# EAGLE design Zio Qwiic MP3 Player (EAGLE 9.1.1)
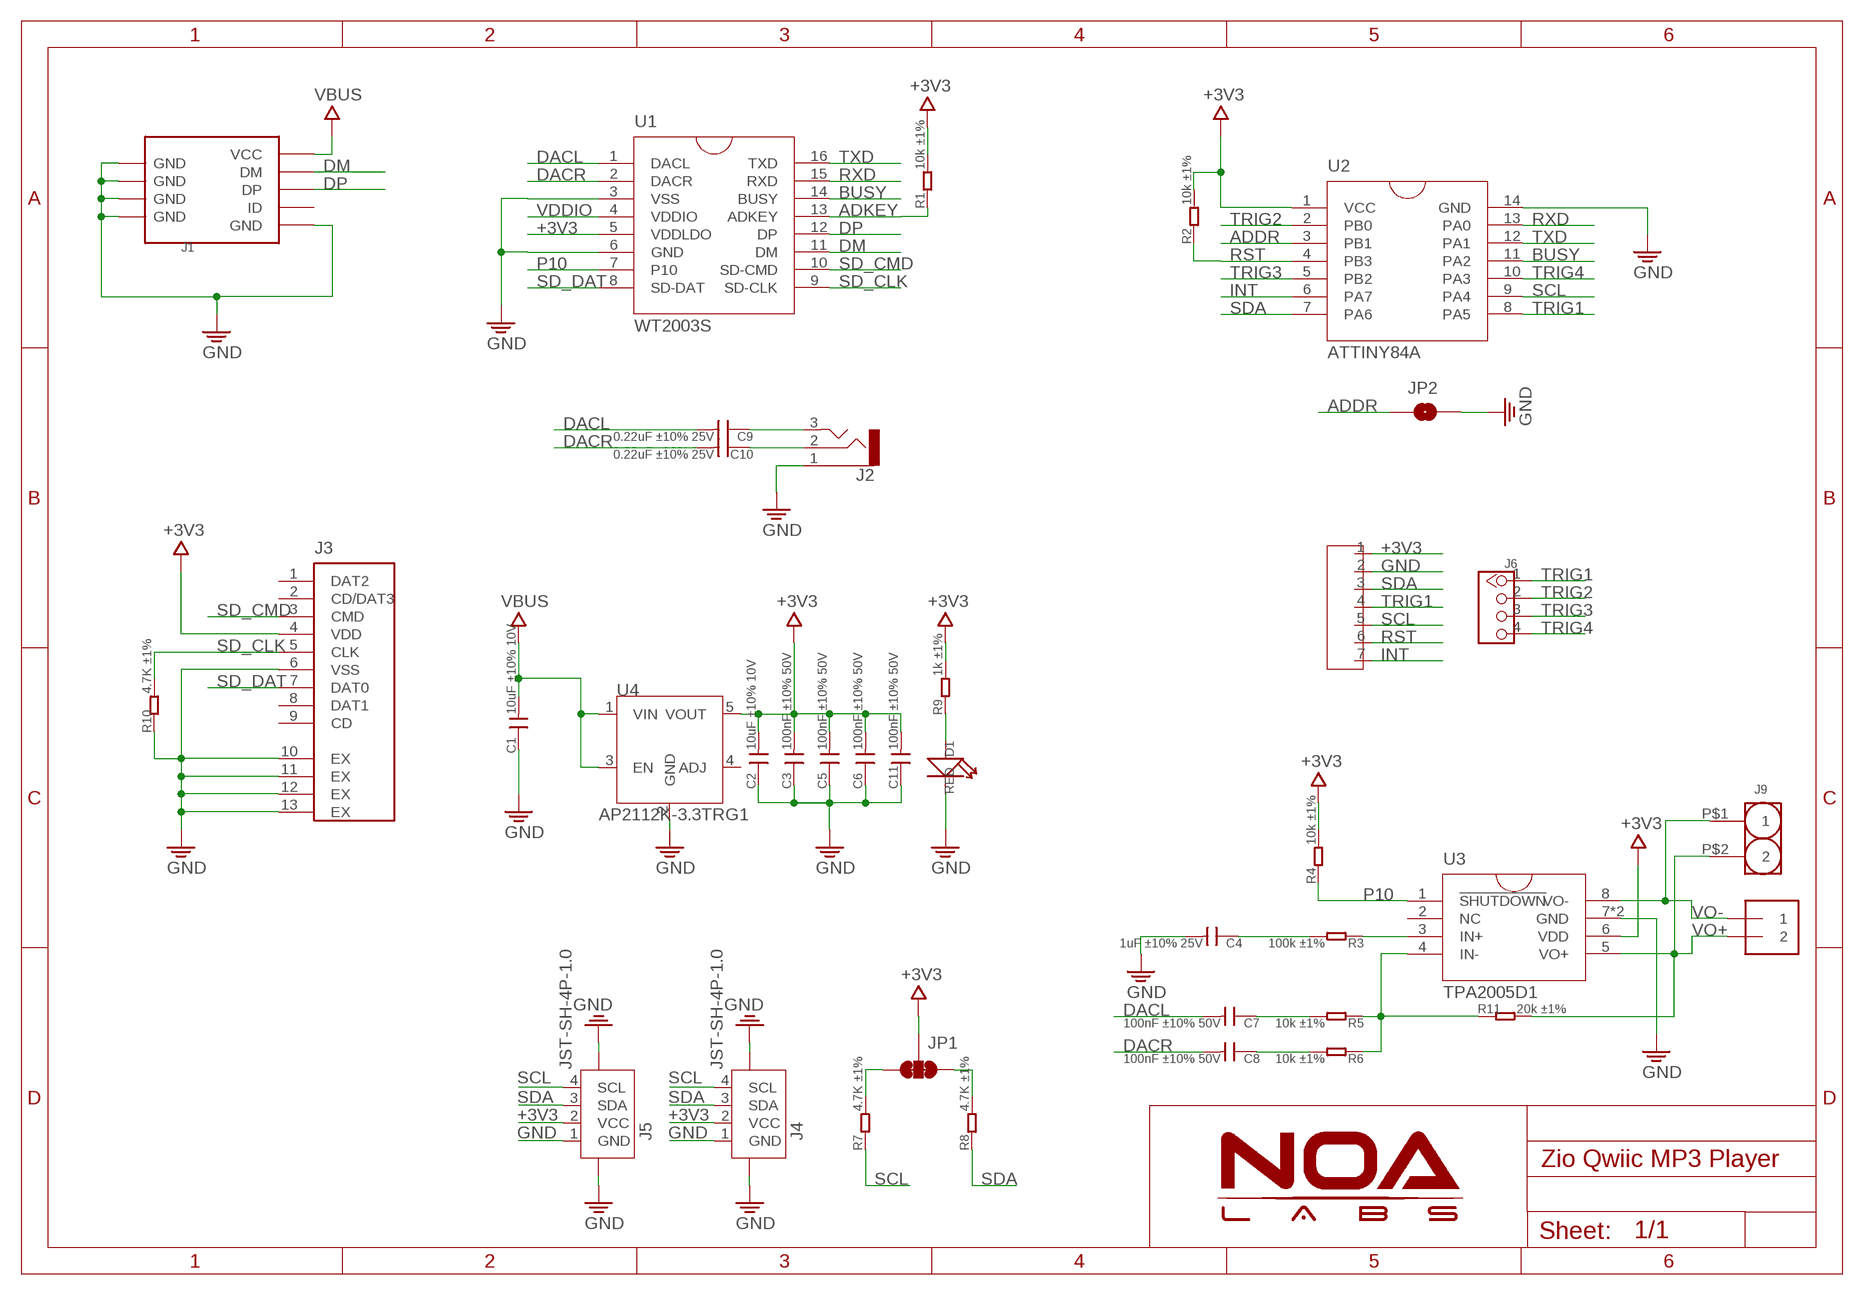
[diagram p0: schematic, sheet 1]

## Parts
C1  10uF ±10% 10V  C-0603  [C0603]
C2  10uF ±10% 10V  C-0603  [C0603]
C3  100nF ±10% 50V  C-0603  [C0603]
C4  1uF ±10% 25V  C-0603  [C0603]
C5  100nF ±10% 50V  C-0603  [C0603]
C6  100nF ±10% 50V  C-0603  [C0603]
C7  100nF ±10% 50V  C-0603  [C0603]
C8  100nF ±10% 50V  C-0603  [C0603]
C9  0.22uF ±10% 25V  C-0603  [C0603]
C10  0.22uF ±10% 25V  C-0603  [C0603]
C11  100nF ±10% 50V  C-0603  [C0603]
D1  RED  LED'0603'  [LED-0603]
J1  USB-MICROE  [MICRO-SMD]
J2  AUDIO-3PPJ-320B  [3P-SMD-3.5MM]
J3  TF_CARD  [TF_CARD]
J4  JST-SH-4P-1.0  [JST-SH-4P]
J5  JST-SH-4P-1.0  [JST-SH-4P]
J6  HEADER-4P-60/35MIL  [4P-65/35MIL]
J7  HEADER-7P  [7P-2.54-60/35MIL]
J8  TERMBLOCK_1X2-3.5MM  [1X2-3.5MM]
J9  HEADER-2P  [插片]
JP1  SMT-JUMPER_3_2-NC_TRACE  [SMT-JUMPER_3_2-NC_TRACE]
JP2  JUMPER-SMT_2_NC_PASTE_NOCREM  [SMT-JUMPER_2_NC_PASTE_SILK_NOCREM]
R1  10k ±1%  R-0603  [R0603]
R2  10k ±1%  R-0603  [R0603]
R3  100k ±1%  R-0603  [R0603]
R4  10k ±1%  R-0603  [R0603]
R5  10k ±1%  R-0603  [R0603]
R6  10k ±1%  R-0603  [R0603]
R7  4.7K ±1%  R-0603  [R0603]
R8  4.7K ±1%  R-0603  [R0603]
R9  1k ±1%  R-0603  [R0603]
R10  4.7K ±1%  R-0603  [R0603]
R11  20k ±1%  R-0603  [R0603]
U1  WT2003S  [SO16]
U2  ATTINY84A  [SO14]
U3  TPA2005D1  TPA2005D1POWERPAD  [MSOP-8]
U4  AP2112K-3.3TRG1  AP2112  [SOT23-5]

## Nets
+3V3: C2.2 C3.2 C5.2 C6.2 C11.2 J3.4(VDD) J4.2(VCC) J5.2(VCC) J7.1 JP1.2 R1.2 R2.2 R4.2 R9.2 U1.5(VDDLDO) U2.1(VCC) U3.6(VDD) U4.5(VOUT)
ADDR: JP2.1 U2.3(PB1)
ADKEY: R1.1 U1.13(ADKEY)
BUSY: U1.14(BUSY) U2.11(PA2)
DACL: C7.2 C9.2 U1.1(DACL)
DACR: C8.2 C10.2 U1.2(DACR)
DM: J1.D-(DM) U1.11(DM)
DP: J1.D+(DP) U1.12(DP)
GND: C1.1 C2.1 C3.1 C4.2 C5.1 C6.1 C11.1 D1.- J1.GND J1.S1(GND) J1.S1@1(GND) J1.S1@2(GND) J1.S2(GND) J1.S2@1(GND) J1.S2@2(GND) J1.S3(GND) J1.S3@1(GND) J1.S3@2(GND) J1.S4(GND) J1.S4@1(GND) J1.S4@2(GND) J1.S5(GND) J1.S6(GND) J2.1 J3.6(VSS) J3.10(EX) J3.11(EX) J3.12(EX) J3.13(EX) J4.1(GND) J4.NC1 J4.NC2 J5.1(GND) J5.NC1 J5.NC2 J7.2 JP2.2 R10.1 U1.3(VSS) U1.6(GND) U2.14(GND) U3.7(GND) U3.9(GND) U4.2(GND)
INT: J7.7 U2.6(PA7)
N$3: D1.+ R9.1
N$4: C4.1 R3.2
N$5: R3.1 U3.3(IN+)
N$6: R5.1 R6.1 R11.1 U3.4(IN-)
N$7: C9.1 J2.3
N$8: C10.1 J2.2
N$9: C8.1 R6.2
N$10: C7.1 R5.2
N$34: JP1.3 R7.2
N$36: JP1.1 R8.2
P10: R4.1 U1.7(P10) U3.1(!SHUTDOWN)
RST: J7.6 R2.1 U2.4(PB3)
RXD: U1.15(RXD) U2.13(PA0)
SCL: J4.4(SCL) J5.4(SCL) J7.5 R7.1 U2.9(PA4)
SD_CLK: J3.5(CLK) R10.2 U1.9(SD-CLK)
SD_CMD: J3.3(CMD) U1.10(SD-CMD)
SD_DAT: J3.7(DAT0) U1.8(SD-DAT)
SDA: J4.3(SDA) J5.3(SDA) J7.3 R8.1 U2.7(PA6)
TRIG1: J6.1 J7.4 U2.8(PA5)
TRIG2: J6.2 U2.2(PB0)
TRIG3: J6.3 U2.5(PB2)
TRIG4: J6.4 U2.10(PA3)
TXD: U1.16(TXD) U2.12(PA1)
VBUS: C1.2 J1.VBUS(VCC) U4.1(VIN) U4.3(EN)
VDDIO: U1.4(VDDIO)
VO+: J8.2 J9.P$2 R11.2 U3.5(VO+)
VO-: J8.1 J9.P$1 U3.8(VO-)
Unconnected: J1.ID J3.1(DAT2) J3.2(CD/DAT3) J3.8(DAT1) J3.9(CD) U3.2(NC) U4.4(ADJ)

## Library data of the parts
C1-C11 = RCL:C
D1 = Discrete_NOA:LED*
J1 = Connector_NOA:USB-MICROE
J2 = Connector:AUDIO-3P: 3.5mm Audio Jack Simple 3.5mm common PCB mount audio jack. SKU: PRT-08032
J3 = Connector_NOA:TF_CARD
J4 J5 = Connector:JST-SH-4P
J6 = Connector_NOA:HEADER-4P
J7 = Connector_NOA:HEADER-7P
J8 = microbuilder:TERMBLOCK_1X2: 3.5mm Terminal block http://www.ladyada.net/library/pcb/eaglelibrary.html
J9 = Connector_NOA:HEADER-2P
JP1 = NOA-Jumpers:SMT-JUMPER_3_2-NC_TRACE
JP2 = NOA-Jumpers:JUMPER-SMT_2_NC_PASTE_NOCREM
R1-R11 = RCL:R
U1 = IC_NOA:WT2003S
U2 = IC_NOA:ATTINY84A
U3 = IC_NOA:TPA2005D1
U4 = IC_NOA:AP2112

## Board
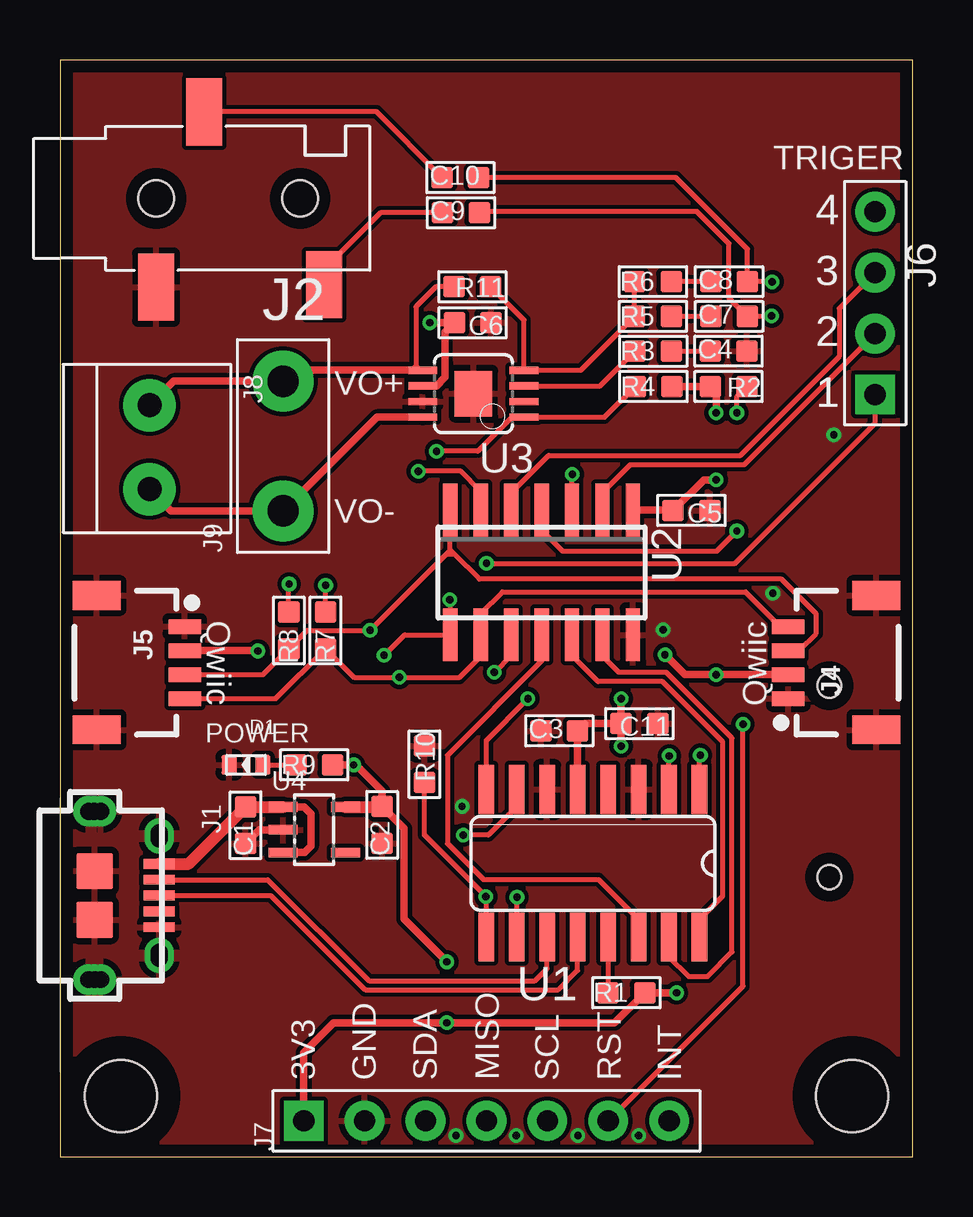
[diagram p1: board, top side]
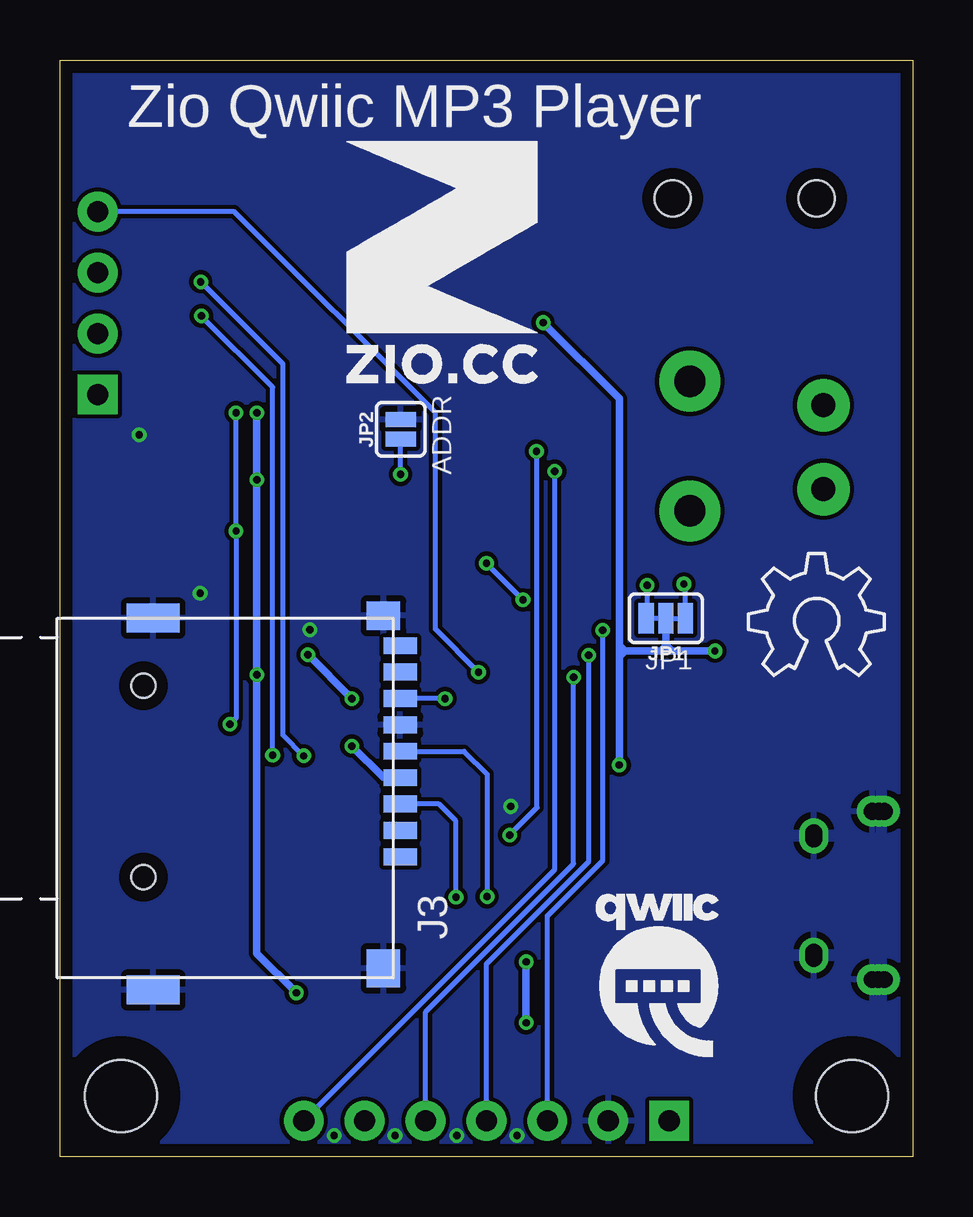
[diagram p2: board, bottom side, seen from below]

Size 35.56 x 45.72 mm. Coordinates in mm from the lower left corner, seen from the top.
Outline: 0,0 35.56,0 35.56,45.72 0,45.72 0,0
Copper layers (1*16): Top 0.035mm / dielectric 1.5mm / Bottom 0.035mm
Design rules "NOA Eagle Rule": minimum track width 7mil, minimum drill 12mil, track to track 7mil, track to pad 7mil, pad to pad 7mil, via to via 7mil, smd to smd 0mil, copper to edge 20mil, drill to drill 10mil, minimum pad ring 10mil, minimum via ring 6mil, stop-mask expansion 2mil, vias tented up to drill 25mil, thermal gap 10mil
Holes 3 mm at 2.54,2.54 33.02,2.54
tRestrict: area 0.1,0.1 to 4.9,4.9; area 30.6,0.1 to 35.4,4.9
bRestrict: area 0.1,0.1 to 4.9,4.9; area 30.6,0.1 to 35.4,4.9

### Footprints (pad centres in the part's own frame; a part is rotated, then mirrored left to right if it is on the bottom)
C0603 = smd 0.889 x 0.889: 1 -0.762,0; 2 0.762,0
LED-0603 = smd 0.635 x 0.8: + 0.699,0; - -0.699,0
MICRO-SMD = smd 0.406 x 1.346: D+ 0,2.057; D- -0.66,2.057; GND 1.321,2.057; ID 0.66,2.057; VBUS -1.321,2.057 | drill 0.7: S1 -2.489,2.057; S1@1 -2.616,2.057; S1@2 -2.362,2.057; S2 2.464,2.057; S2@1 2.362,2.057; S2@2 2.616,2.057 | drill 0.7 pad 1.27: S3 -3.505,-0.66; S3@1 -3.505,-0.381; S3@2 -3.505,-0.889; S4 3.505,-0.635; S4@1 3.505,-0.381; S4@2 3.505,-0.889 | smd 1.524 x 1.524: S5 -1.016,-0.635; S6 1.016,-0.635
3P-SMD-3.5MM = smd 1.5 x 2.8: 1 3,3.7; 2 1,-3.6; 3 -4,3.6 | hole 1.5: -3,0; 3,0
TF_CARD = smd 0.7 x 1.4: 1 9.95,10.3; 2 8.85,10.3; 3 7.75,10.3; 4 6.65,10.3; 5 5.55,10.3; 6 4.45,10.3; 7 3.35,10.3; 8 2.25,10.3; 9 1.15,10.3 | smd 1.2 x 1.4: 10 -0.1,9.6 | smd 1.2 x 2.2: 11 0,0; 12 15.5,0 | smd 1.6 x 1.4: 13 14.6,9.6 | hole 1: 2.82,-0.4; 10.8,-0.4
JST-SH-4P = smd 0.6 x 1.35: 1 1.5,0; 2 0.5,0; 3 -0.5,0; 4 -1.5,0 | smd 1.2 x 2: NC1 -2.8,3.675; NC2 2.8,3.675
4P-65/35MIL = drill 0.889 pad 1.651 square: 1 0,3.81 | drill 0.889 pad 1.651: 2 0,1.27; 3 0,-1.27; 4 0,-3.81
7P-2.54-60/35MIL = drill 0.889 pad 1.651 square: 1 0,7.62 | drill 0.889 pad 1.651: 2 0,5.08; 3 0,2.54; 4 0,0; 5 0,-2.54; 6 0,-5.08; 7 0,-7.62
1X2-3.5MM = drill 1 pad 2.184: 1 1.8,0; 2 -1.7,0
插片 = drill 1.3 pad 2.54: P$1 -2.7,0; P$2 2.7,0
SMT-JUMPER_3_2-NC_TRACE = smd 0.635 x 1.27: 1 -0.813,0; 2 0,0; 3 0.813,0
SMT-JUMPER_2_NC_PASTE_SILK_NOCREM = smd 0.635 x 1.27: 1 -0.406,0; 2 0.406,0
R0603 = smd 0.889 x 0.889: 1 -0.762,0; 2 0.762,0
SO16 = smd 0.66 x 2.032: 1 -4.445,-3.073; 2 -3.175,-3.073; 3 -1.905,-3.073; 4 -0.635,-3.073; 5 0.635,-3.073; 6 1.905,-3.073; 7 3.175,-3.073; 8 4.445,-3.073; 9 4.445,3.073; 10 3.175,3.073; 11 1.905,3.073; 12 0.635,3.073; 13 -0.635,3.073; 14 -1.905,3.073; 15 -3.175,3.073; 16 -4.445,3.073
SO14 = smd 0.6 x 2.2: 1 -3.81,-2.6; 2 -2.54,-2.6; 3 -1.27,-2.6; 4 0,-2.6; 5 1.27,-2.6; 6 2.54,-2.6; 7 3.81,-2.6; 8 3.81,2.6; 9 2.54,2.6; 10 1.27,2.6; 11 0,2.6; 12 -1.27,2.6; 13 -2.54,2.6; 14 -3.81,2.6
MSOP-8 = smd 0.3 x 1.2: 1 -0.976,-2.113; 2 -0.326,-2.113; 3 0.324,-2.113; 4 0.974,-2.113; 5 0.974,2.112; 6 0.324,2.112; 7 -0.326,2.112; 8 -0.976,2.112 | smd 1.89 x 1.57: 9 0,0
SOT23-5 = smd 0.4 x 1.2: 1 -0.95,-1.3; 2 0,-1.3; 3 0.95,-1.3; 4 0.95,1.3; 5 -0.95,1.3

### Placement (x,y rotation side)
C1  7.74,13.82 90 top
C2  13.43,13.83 90 top
C3  20.82,17.76 0 top
C4  27.87,33.58 0 top
C5  26.32,26.94 180 top
C6  17.2,34.77 180 top
C7  27.89,35.03 0 top
C8  27.89,36.48 0 top
C9  16.72,39.35 0 top
C10  16.69,40.82 0 top
C11  24.16,18.06 180 top
D1  7.75,16.34 0 top
J1  2.08,10.89 270 top
J2  7.01,39.95 180 top
J3  31.67,22.45 270 bottom
J4  30.36,20.6 270 top
J5  5.2,20.6 90 top
J6  33.99,35.59 180 top
J7  17.78,1.5 90 top
J8  3.73,29.63 270 top
J9  9.3,29.63 90 top
JP1  10.3,22.44 180 bottom
JP2  21.36,30.32 90 bottom
R1  23.61,6.84 0 top
R2  27.87,32.11 180 top
R3  24.73,33.58 0 top
R4  24.75,32.11 0 top
R5  24.72,35.03 0 top
R6  24.72,36.48 0 top
R7  11.07,21.94 90 top
R8  9.54,21.94 90 top
R9  10.6,16.34 0 top
R10  15.19,16.36 270 top
R11  17.2,36.27 180 top
U1  22.22,12.24 180 top
U2  20.08,24.36 180 top
U3  17.24,31.81 90 top
U4  10.6,13.63 270 top
U$11  [10MM]  23.62,32.26 0 bottom
U$12  [QWIIC-LOGO-MEDIUM]  10.67,7.62 0 bottom
U$13  [OSHW_6X200_NOTEXT]  6.86,20.07 0 bottom

### Tracks (layer width: path | path; a pad name or v marks a point on that pad's centre or on a via)
+3V3  (via drill 0.3)
  Top 0.305: U1.5 C3.2 21.88,18.06 C11.2 | C11.2 v23.39,17.12 | U2.1 25.55,26.96 C5.2 26.84,28.22 v27.36,28.22 | v27.36,20.09 v27.36,20.1 | v27.36,20.1 J4.2 | v27.36,31.01 27.36,31.86 R2.2 R4.2 | v15.42,34.77 C6.2 16.05,34.38 16.05,33.07 16.05,32.5 15.69,32.13 U3.6 | v12.24,16.34 12.34,16.34 13.43,15.24 C2.2 14.34,13.68 14.34,9.91 v16.13,8.13 | v12.24,16.34 v12.24,16.33 | J5.2 8.24,21.1 v8.26,21.08 | J7.1 10.16,4.34 11.4,5.59 v16.13,5.59 23.12,5.59 R1.2 v25.7,6.84 v25.7,6.83 | C11.2 v23.39,19.1 | v25.22,20.93 26.05,20.1 v27.36,20.1 | R9.2 v12.24,16.34
  Top 0.508: U4.5 13.42,14.58 C2.2
  Bottom 0.305: v23.39,17.12 22.08,15.8 J3.4 | v27.36,31.01 v27.36,28.22 v27.36,20.09 27.36,8.48 v25.7,6.83 | v15.42,34.77 12.24,31.6 12.24,21.31 | v8.26,21.08 10.06,21.08 | 10.06,21.08 10.52,21.08 | JP1.2 10.3,21.33 | 10.3,21.33 10.06,21.08 | 10.3,21.33 10.3,21.29 10.52,21.08 | v16.13,8.13 v16.13,5.59 | v23.39,19.1 v25.22,20.93 | v12.24,16.33 12.24,20.85 | 12.24,20.85 12.24,21.31 | 10.52,21.08 12.01,21.08 | 12.01,21.08 12.24,21.31 | 12.01,21.08 12.24,20.85
ADDR  (via drill 0.3)
  Top 0.203: U2.3 21.34,28.43 v21.36,28.45
  Bottom 0.203: v21.36,28.45 JP2.1
ADKEY
  Top 0.203: U1.13 R1.1
BUSY
  Top 0.203: U1.14 24.12,9.89 22.45,11.56 17.65,11.56 16.15,13.06 16.15,16.74 20.07,20.66 U2.11
DACL  (via drill 0.3)
  Top 0.203: U1.1 26.66,16.7 v26.7,16.74 | v29.67,35.05 29.65,35.03 C7.2 27.89,35.8 27.89,38.07 26.55,39.41 17.54,39.41 C9.2
  Bottom 0.203: v26.7,16.74 26.7,32.08 v29.67,35.05
DACR  (via drill 0.3)
  Top 0.203: U1.2 v25.39,16.7 v25.4,16.71 | v29.69,36.47 v29.69,36.48 C8.2 28.66,37.84 25.67,40.82 C10.2
  Bottom 0.203: v25.4,16.71 26.26,17.58 26.26,33.05 v29.69,36.47
DM
  Top 0.203: J1.D- 8.67,11.55 12.88,7.34 19.81,7.34 20.31,7.84 U1.11
DP
  Top 0.203: J1.D+ 8.79,10.89 12.72,6.96 20.78,6.96 21.58,7.76 U1.12
GND  (via drill 0.3)
  Top 0.305: U4.2 8.31,13.63 C1.1
  other vias: 16.51,0.89 19.02,0.89 21.59,0.89 24.13,0.89 16.76,14.61 25.15,21.97 32.26,30.1 29.72,23.5
  pour Top: 0,45.72 35.56,45.72 35.56,0 0,0
  pour Bottom: 0,45.72 35.56,45.72 35.56,0 0,0
INT  (via drill 0.3)
  Top 0.203: U2.6 17.54,27.75 16.71,28.57 v14.94,28.57
  Bottom 0.203: v14.94,28.57 14.94,11.96 J7.7
N$3
  Top 0.203: D1.+ R9.1
N$4
  Top 0.203: R3.2 C4.1
N$5
  Top 0.203: U3.3 22.52,32.13 R3.1
N$6
  Top 0.203: R6.1 R5.1 21.71,32.78 U3.4 19.35,34.88 R11.1
N$7
  Top 0.203: J2.3 11.01,36.99 13.37,39.35 C9.1
N$8
  Top 0.203: C10.1 13.2,43.55 J2.2
N$9
  Top 0.203: C8.1 R6.2
N$10
  Top 0.203: C7.1 R5.2
N$34  (via drill 0.3)
  Top 0.203: R7.2 11.07,23.82 v11.07,23.82
  Bottom 0.203: JP1.3 11.07,22.49 v11.07,23.82
N$36  (via drill 0.3)
  Top 0.203: R8.2 9.54,23.87 v9.55,23.88
  Bottom 0.203: JP1.1 9.49,23.82 v9.55,23.88
P10  (via drill 0.3)
  Top 0.203: R4.1 22.7,30.83 U3.1 18.84,30.83 17.42,29.41 v15.7,29.41 | U1.7 19.04,14.6 17.86,13.41 v16.82,13.41
  Bottom 0.203: v16.82,13.41 15.67,14.55 15.67,29.36 15.7,29.39 v15.7,29.41
RST  (via drill 0.3)
  Top 0.203: U2.4 20.07,26.13 20.95,25.25 25.38,25.25 27.38,25.25 v28.22,26.09 | v28.22,31.01 28.22,31.7 R2.1 | J7.6 28.47,7.11 v28.47,18.03
  Bottom 0.203: v28.22,31.01 v28.22,26.09 28.22,18.29 v28.47,18.03
RXD
  Top 0.203: U1.15 25.39,8.34 26.21,7.52 27,7.52 28.02,8.53 28.02,17.45 25.28,20.19 23.29,20.19 22.61,20.87 U2.13
SCL  (via drill 0.3)
  Top 0.203: J5.4 8.99,19.1 R7.1 12.25,19.99 v14.15,19.99 16.66,19.99 17.54,20.86 U2.9 17.54,22.64 18.44,23.55 28.57,23.55 30.02,22.1 J4.4
  Bottom 0.203: J7.5 20.32,6.04 14.15,12.21 v14.15,19.99
SD_CLK  (via drill 0.3)
  Top 0.203: U1.9 17.75,9.18 v17.75,10.85 15.19,13.41 R10.2
  Bottom 0.203: J3.5 18.71,16.9 17.75,15.95 v17.75,10.85
SD_CMD  (via drill 0.3)
  Top 0.203: U1.10 v19.04,10.81 v19.05,10.82
  Bottom 0.203: v19.05,10.82 19.05,13.99 19.76,14.7 J3.3
SD_DAT  (via drill 0.3)
  Top 0.203: U1.8 17.77,17.37 v19.51,19.1
  Bottom 0.203: v19.51,19.1 J3.7
SDA  (via drill 0.3)
  Top 0.203: J5.3 8.47,20.1 R8.1 10.31,21.95 v12.93,21.95 16.12,25.13 | 16.27,25.3 16.27,25.28 16.12,25.13 | 16.27,25.3 U2.7 | J4.3 30.8,21.1 31.52,21.82 31.52,22.63 30.07,24.08 17.48,24.08 16.45,25.11 | 16.45,25.11 16.27,25.3 | 16.12,25.13 16.43,25.13 16.45,25.11
  Bottom 0.203: J7.3 15.24,10.04 14.04,11.24 12.93,12.36 v12.93,21.95
TRIG1  (via drill 0.3)
  Top 0.203: v16.26,23.22 16.26,21.77 U2.8 14.37,21.76 v13.51,20.9 | J6.1 33.98,30.58 28.14,24.74 v17.78,24.74
  Bottom 0.203: v17.78,24.74 v16.26,23.22 | J7.4 17.78,8.04 13.51,12.31 v13.51,20.9
TRIG2
  Top 0.203: U2.2 22.61,27.7 23.77,28.85 28.52,28.85 J6.2
TRIG3
  Top 0.203: U2.5 18.8,27.67 20.37,29.23 28.37,29.23 31.82,32.69 32.49,33.36 32.49,35.36 J6.3
TRIG4  (via drill 0.3)
  Top 0.203: U2.10 18.8,20.89 v18.11,20.19
  Bottom 0.203: v18.11,20.19 19.91,22 19.91,31.01 28.3,39.4 J6.4
TXD
  Top 0.203: U1.16 26.66,9.9 27.64,10.87 27.64,17.3 25.12,19.81 22.43,19.81 21.34,20.89 U2.12
VBUS
  Top 0.305: U4.1 10.18,14.58 10.46,14.3 10.46,12.95 10.19,12.68 U4.3
  Top 0.508: J1.VBUS 5.36,12.21 C1.2 U4.1
VO+
  Top 0.203: R11.2 15.67,36.27 14.83,35.43 14.83,32.96 | 14.83,32.96 14.66,32.78 | 14.83,32.96 15.01,32.78 U3.5
  Top 0.305: U3.5 14.66,32.78 9.76,32.78 J9.P$2 4.73,32.33 J8.2
VO-
  Top 0.305: U3.8 13.21,30.83 J9.P$1 4.64,26.93 J8.1

### Text on the board
tPlace: TRIGER | 4 | 3 | 2 | VO+ | 1 | VO- | Qwiic | Qwiic | POWER | 3V3 | GND | SDA | MISO | SCL | RST | INT
bPlace: Zio Qwiic MP3 Player | ADDR | JP1